# EAGLE design controller (EAGLE 9.6.2)
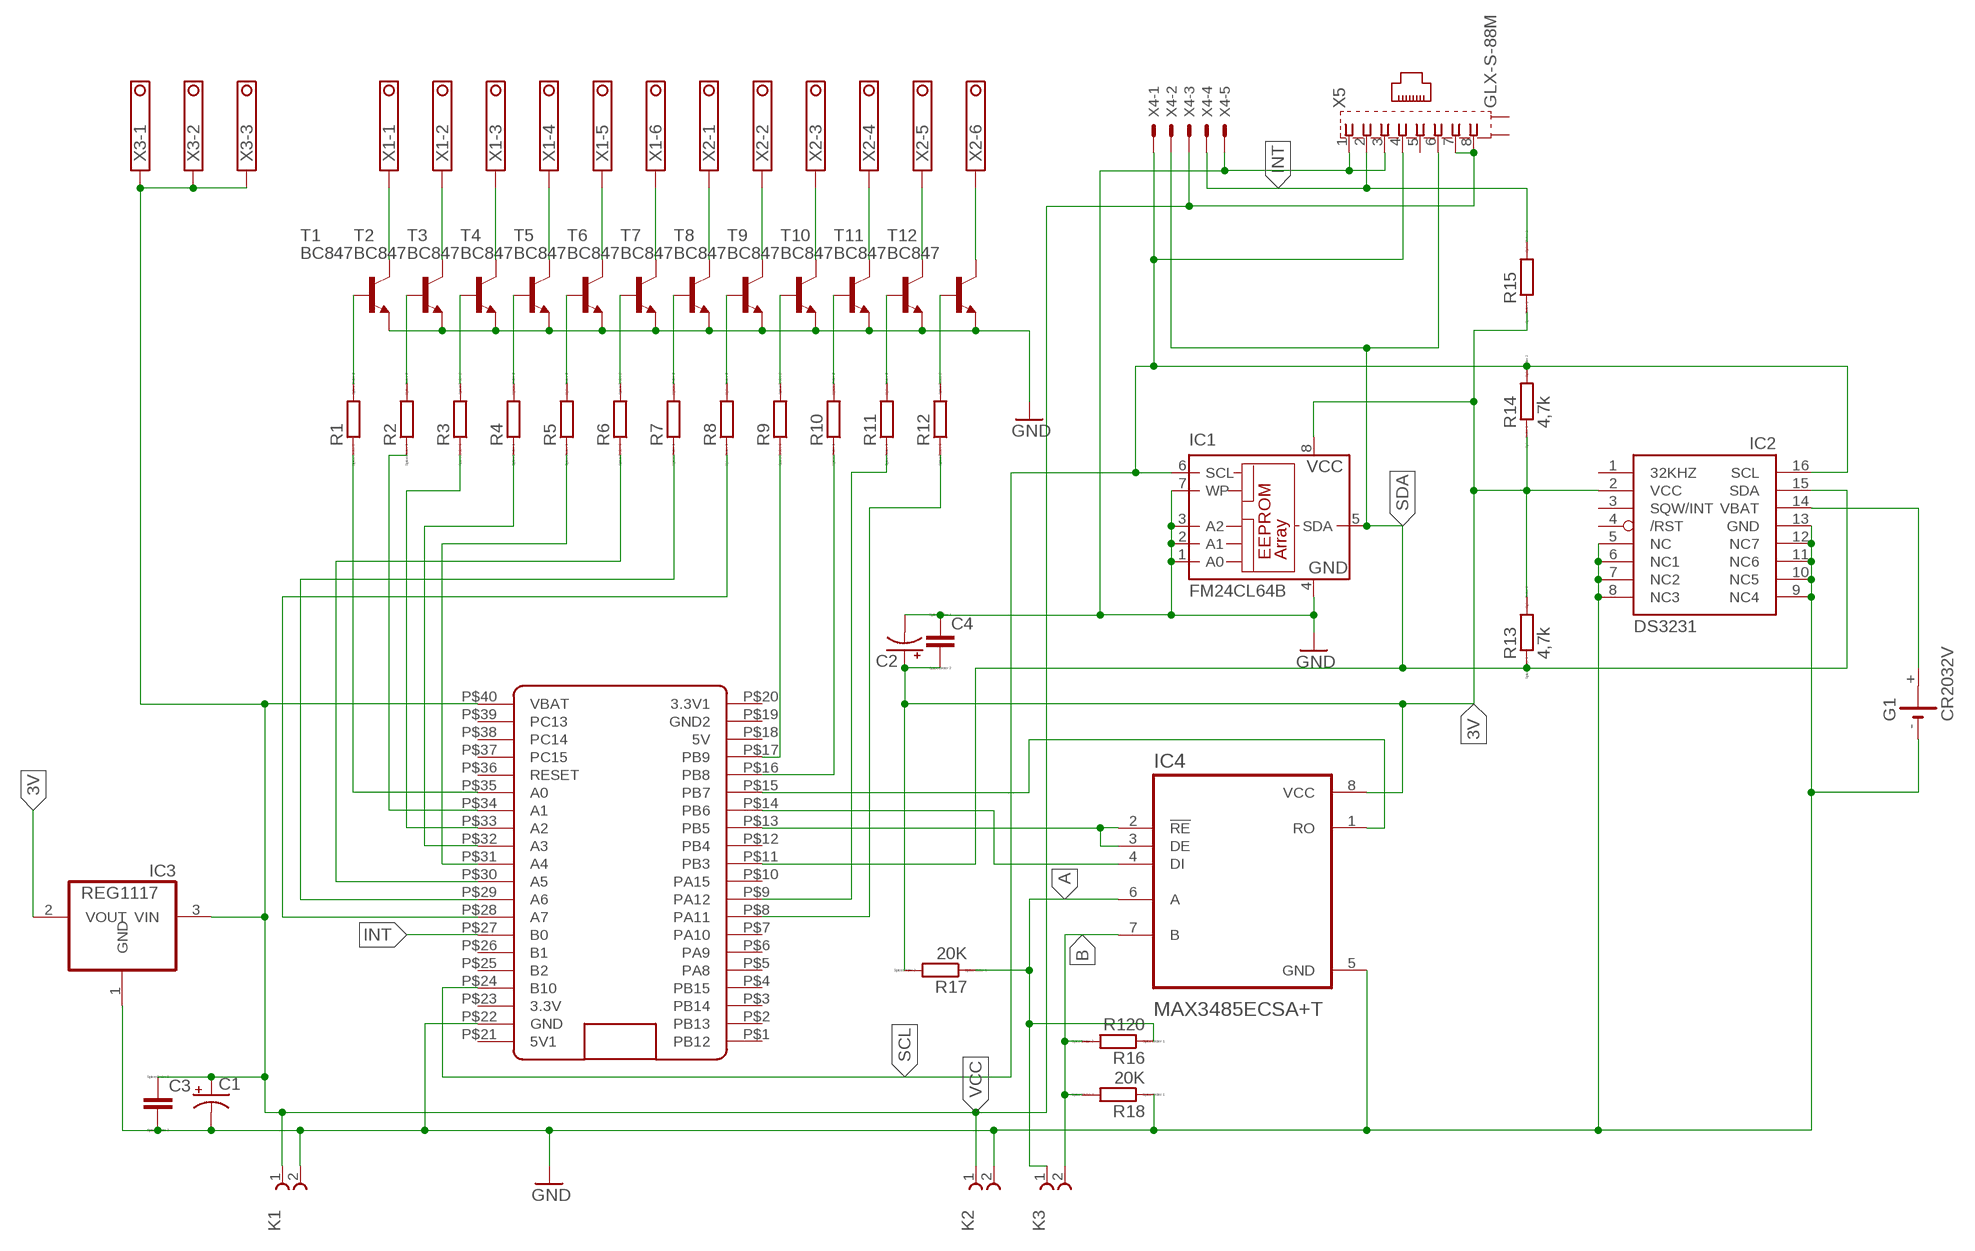
[diagram p0: schematic, sheet 1]

## Parts
C1  CPOL-US153CLV-0810  [153CLV-0810]
C2  CPOL-US153CLV-0810  [153CLV-0810]
C3  C  [C0805]
C4  C  [C0805]
G1  CR2032V  [CR2032V]
IC1  FM24CL64B  24C64SM  [SO-08M]
IC2  DS3231  DS3231/SO  [SO16W]
IC3  REG1117  [SOT223]
IC4  MAX3485ECSA+T  [SOIC127P600X175-8N]
K1  691218410002  [691218410002]
K2  691218410002  [691218410002]
K3  691218410002  [691218410002]
R1  RR1206  [R1206]
R2  RR1206  [R1206]
R3  RR1206  [R1206]
R4  RR1206  [R1206]
R5  RR1206  [R1206]
R6  RR1206  [R1206]
R7  RR1206  [R1206]
R8  RR1206  [R1206]
R9  RR1206  [R1206]
R10  RR1206  [R1206]
R11  RR1206  [R1206]
R12  RR1206  [R1206]
R13  4,7k  RR1206  [R1206]
R14  4,7k  RR1206  [R1206]
R15  RR1206  [R1206]
R16  R120  RR1206  [R1206]
R17  20K  RR1206  [R1206]
R18  20K  RR1206  [R1206]
T1  BC847  [SOT23]
T2  BC847  [SOT23]
T3  BC847  [SOT23]
T4  BC847  [SOT23]
T5  BC847  [SOT23]
T6  BC847  [SOT23]
T7  BC847  [SOT23]
T8  BC847  [SOT23]
T9  BC847  [SOT23]
T10  BC847  [SOT23]
T11  BC847  [SOT23]
T12  BC847  [SOT23]
U$1  BLACK_STM32F411  [BLACK_PILL]
X1  TERMINAL-BLOCK-3.5MM-6-PIN-LONG-PAD  [TERMINAL-BLOCK-6-PIN-3.5MM-LONG-PAD]
X2  TERMINAL-BLOCK-3.5MM-6-PIN-LONG-PAD  [TERMINAL-BLOCK-6-PIN-3.5MM-LONG-PAD]
X3  TERMINAL-BLOCK-3.5MM-3-PIN-LONG-PAD  [TERMINAL-BLOCK-3-PIN-3.5MM-LONG-PAD]
X4  JST-XH-05-PIN-LONG-PAD  [JST-XH-05-PACKAGE-LONG-PAD]
X5  GLX-S-88M  [GLX-S-88M]

## Nets
3V: C2.+ C4.2 IC1.8(VCC) IC2.2(VCC) IC3.2(VOUT) IC4.8(VCC) R13.2 R14.1 R15.1 R17.2
A: IC4.6(A) K3.1 R16.1 R17.1
B: IC4.7(B) K3.2 R16.2 R18.2
GND: C1.- C2.- C3.2 C4.1 G1.- IC1.1(A0) IC1.2(A1) IC1.3(A2) IC1.4(GND) IC1.7(WP) IC2.5(NC) IC2.6(NC1) IC2.7(NC2) IC2.8(NC3) IC2.9(NC4) IC2.10(NC5) IC2.11(NC6) IC2.12(NC7) IC2.13(GND) IC3.1(GND) IC4.5(GND) K1.2 K2.2 R18.1 T1.2(E) T2.2(E) T3.2(E) T4.2(E) T5.2(E) T6.2(E) T7.2(E) T8.2(E) T9.2(E) T10.2(E) T11.2(E) T12.2(E) U$1.P$22(GND) X4.5 X5.1 X5.3
INT: R15.2 U$1.P$27(B0) X4.4 X5.2
N$3: G1.+ IC2.14(VBAT)
N$4: IC4.2(!RE) IC4.3(DE) U$1.P$13(PB5)
N$5: IC4.4(DI) U$1.P$14(PB6)
N$6: IC4.1(RO) U$1.P$15(PB7)
N$7: R1.1 U$1.P$35(A0)
N$8: R2.1 U$1.P$34(A1)
N$9: R3.1 U$1.P$33(A2)
N$10: R4.1 U$1.P$32(A3)
N$11: R5.1 U$1.P$31(A4)
N$12: R6.1 U$1.P$30(A5)
N$13: R7.1 U$1.P$29(A6)
N$14: R8.1 U$1.P$28(A7)
N$15: R9.1 U$1.P$17(PB9)
N$16: R10.1 U$1.P$16(PB8)
N$17: R11.1 U$1.P$9(PA12)
N$18: R12.1 U$1.P$8(PA11)
N$19: R1.2 T1.1(B)
N$20: R2.2 T2.1(B)
N$21: R3.2 T3.1(B)
N$22: R4.2 T4.1(B)
N$23: R5.2 T5.1(B)
N$24: R6.2 T6.1(B)
N$25: R7.2 T7.1(B)
N$26: R8.2 T8.1(B)
N$27: R9.2 T9.1(B)
N$28: R10.2 T10.1(B)
N$29: R11.2 T11.1(B)
N$30: R12.2 T12.1(B)
N$32: T1.3(C) X1.1
N$33: T2.3(C) X1.2
N$34: T3.3(C) X1.3
N$35: T4.3(C) X1.4
N$36: T5.3(C) X1.5
N$37: T6.3(C) X1.6
N$38: T7.3(C) X2.1
N$39: T8.3(C) X2.2
N$40: T9.3(C) X2.3
N$41: T10.3(C) X2.4
N$42: T11.3(C) X2.5
N$43: T12.3(C) X2.6
SCL: IC1.6(SCL) IC2.16(SCL) R14.2 U$1.P$24(B10) X4.1 X5.4
SDA: IC1.5(SDA) IC2.15(SDA) R13.1 U$1.P$11(PB3) X4.2 X5.6
VCC: C1.+ C3.1 IC3.3(VIN) K1.1 K2.1 U$1.P$40(VBAT) X3.1 X3.2 X3.3 X4.3 X5.7 X5.8
Unconnected: G1.+@1(+) IC2.1(32KHZ) IC2.3(SQW/INT) IC2.4(/RST) U$1.P$1(PB12) U$1.P$2(PB13) U$1.P$3(PB14) U$1.P$4(PB15) U$1.P$5(PA8) U$1.P$6(PA9) U$1.P$7(PA10) U$1.P$10(PA15) U$1.P$12(PB4) U$1.P$18(5V) U$1.P$19(GND2) U$1.P$20(3.3V1) U$1.P$23(3.3V) U$1.P$25(B2) U$1.P$26(B1) U$1.P$36(RESET) U$1.P$37(PC15) U$1.P$38(PC14) U$1.P$39(PC13) X5.5 X5.S1 X5.S2

## Power pins joined to a net without a drawn wire
5V1: U$1.P$21(5V1)

## Library data of the parts
C1 C2 = adafruit:CPOL-US: POLARIZED CAPACITOR, American symbol
C3 C4 = eagle-ltspice:C: CAPACITOR, European symbol; SPICEMODEL: NONE; SPICEPREFIX: C
G1 = battery:CR2032V: LI BATTERY Varta
IC1 = microchip:24*: Serial EEPROM I2C; MF: RAMTRON INTERNATIONAL CORP; MPN: FM24C64-S; OC_FARNELL: 9882685; OC_NEWARK: 98H0189
IC2 = adafruit:DS3231
IC3 = burr-brown:REG1117: 800mA and 1A Low Dropout (LDO) Positive Regulator 1.8V, 2.5V, 2.85V, 3.3V, 5V, and Adj; MPN: REG1117; OC_FARNELL: 1097566; OC_NEWARK: 14P6981
IC4 = MAX3485ECSA_T:MAX3485ECSA+T: Check prices <https://pricing.snapeda.com/parts/MAX3485ECSA%2BT/Maxim%20Integrated/view-part?ref=eda>; AVAILABILITY: Warning; DESCRIPTION: 1/1 Transceiver Half RS422, RS485 8-SOIC; MF: Maxim Integrated; MP: MAX3485ECSA+T; PACKAGE: SOIC-8 Maxim; PRICE: None; PURCHASE-URL: https://pricing.snapeda.com/search/part/MAX3485ECSA+T/?ref=eda
K1-K3 = Wurth_Elektronik_Electromechanic_Terminal_Blocks_Connectors_rev15c:691218410002: WR-TBL Serie 2184 - 7.62mm Horizontal Entry Modular with Rising Cage Clamp - 5.3mm2 Wires, 2 Pins=>Code : Con_TBL_Screw_RisingClamp_7.62_691218410002 <http://katalog.we-online.de/media/images/eican/Con_TBL_Screw_RisingClamp_7.62_6912184100xx_pf2.jpg> Details see: http://katalog.we-online.de/en/em/691_218_410_0xx Created 2014-06-18, Karrer Zheng 2014 (C) Würth Elektronik
R1-R18 = eagle-ltspice:R: RESISTOR, European symbol; SPICEMODEL: NONE; SPICEPREFIX: R
T1-T12 = nxp_60:BC847: 45 V, 100 mA NPN general-purpose transistors NPN general-purpose transistor AAL Eindhoven MK
U$1 = BluePill:BLACK_STM32F411
X1 X2 = Rembrandt Electronics - Terminal Block 3-5mm v1-0:TERMINAL-BLOCK-3.5MM-6-PIN: Terminal Block 3.5mm Pitch: 3,5 mm Number of pins: 6 Created by Rembrandt Electronics www.rembrandtelectronics.com
X3 = Rembrandt Electronics - Terminal Block 3-5mm v1-0:TERMINAL-BLOCK-3.5MM-3-PIN: Terminal Block 3.5mm Pitch: 3,5 mm Number of pins: 3 Created by Rembrandt Electronics www.rembrandtelectronics.com
X4 = Rembrandt Electronics - JST XH Connectors v1-0:JST-XH-05-PIN: JST XH Connector 2 Pin Wire to board connector. Pitch: 2,54 mm, (0.100") Number of pins: 5 Created by Rembrandt Electronics www.rembrandtelectronics.com
X5 = con-kycon:GLX-S-88M: Mod. Jack, Right Angle, 8 posiotion, 8 contatcs RJ45 Source: GLX-S-88M.pdf; OC_FARNELL: unknown; OC_NEWARK: unknown

## Board
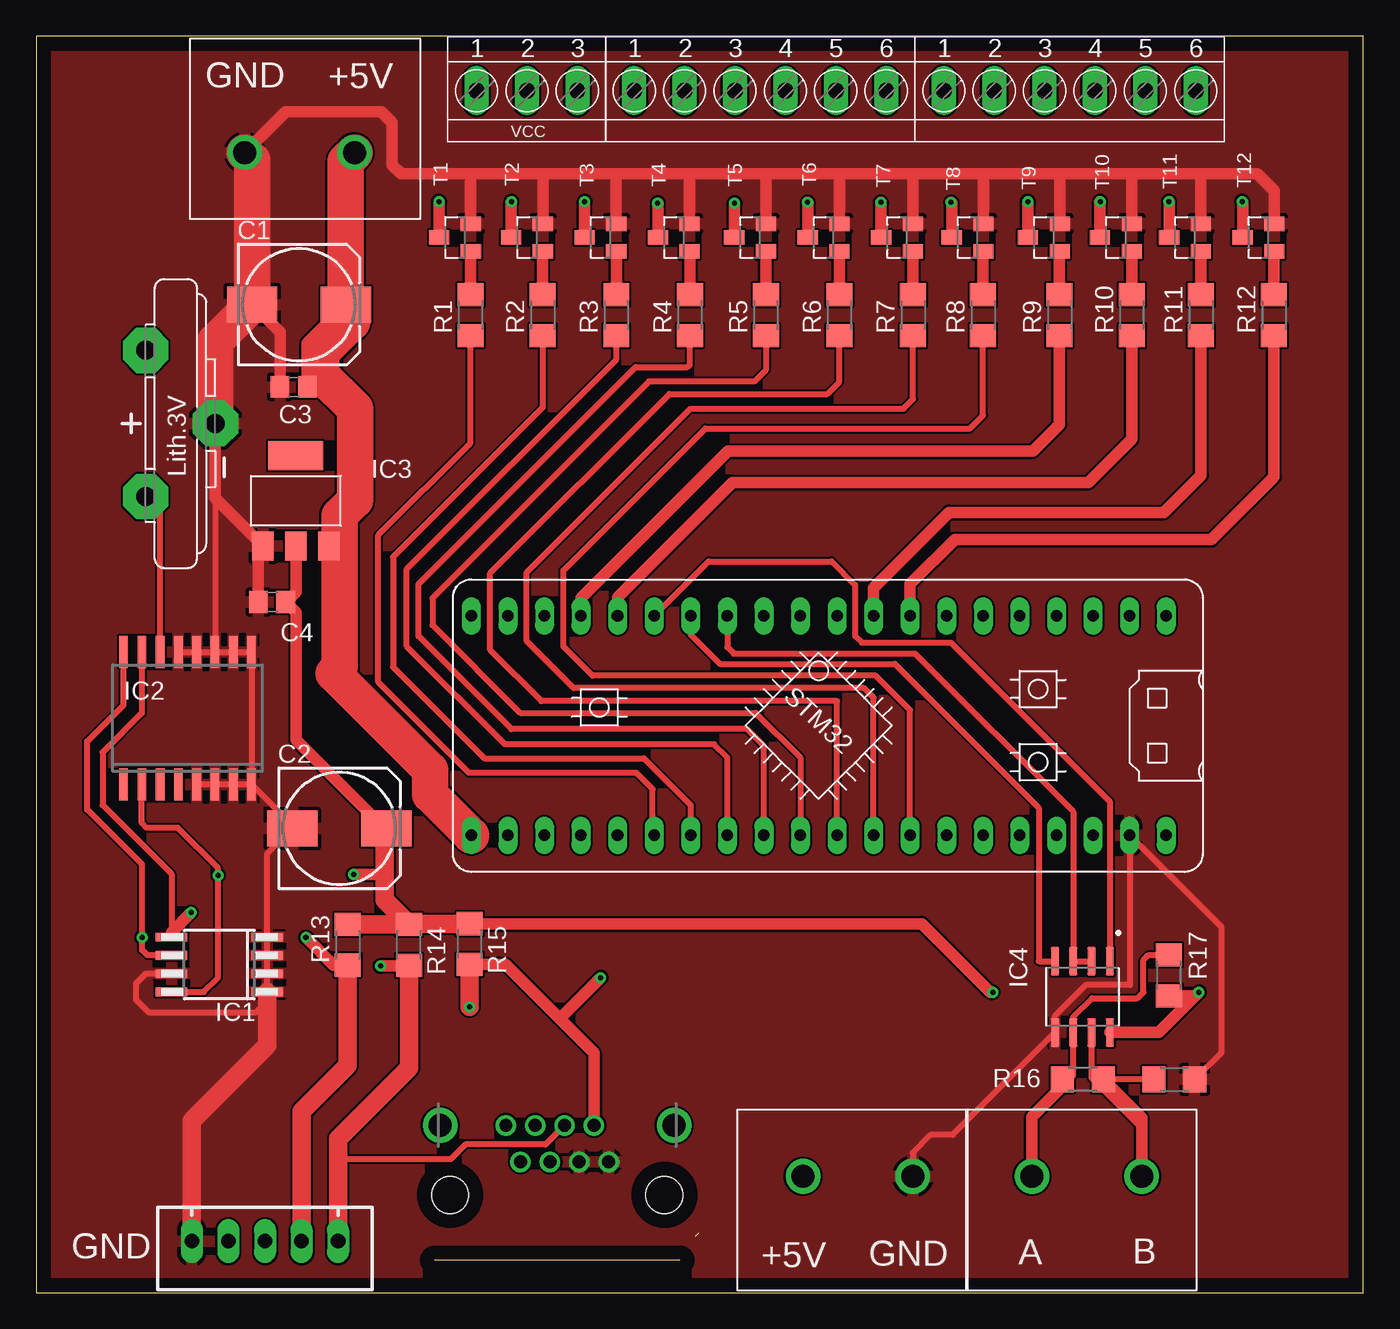
[diagram p1: board, top side]
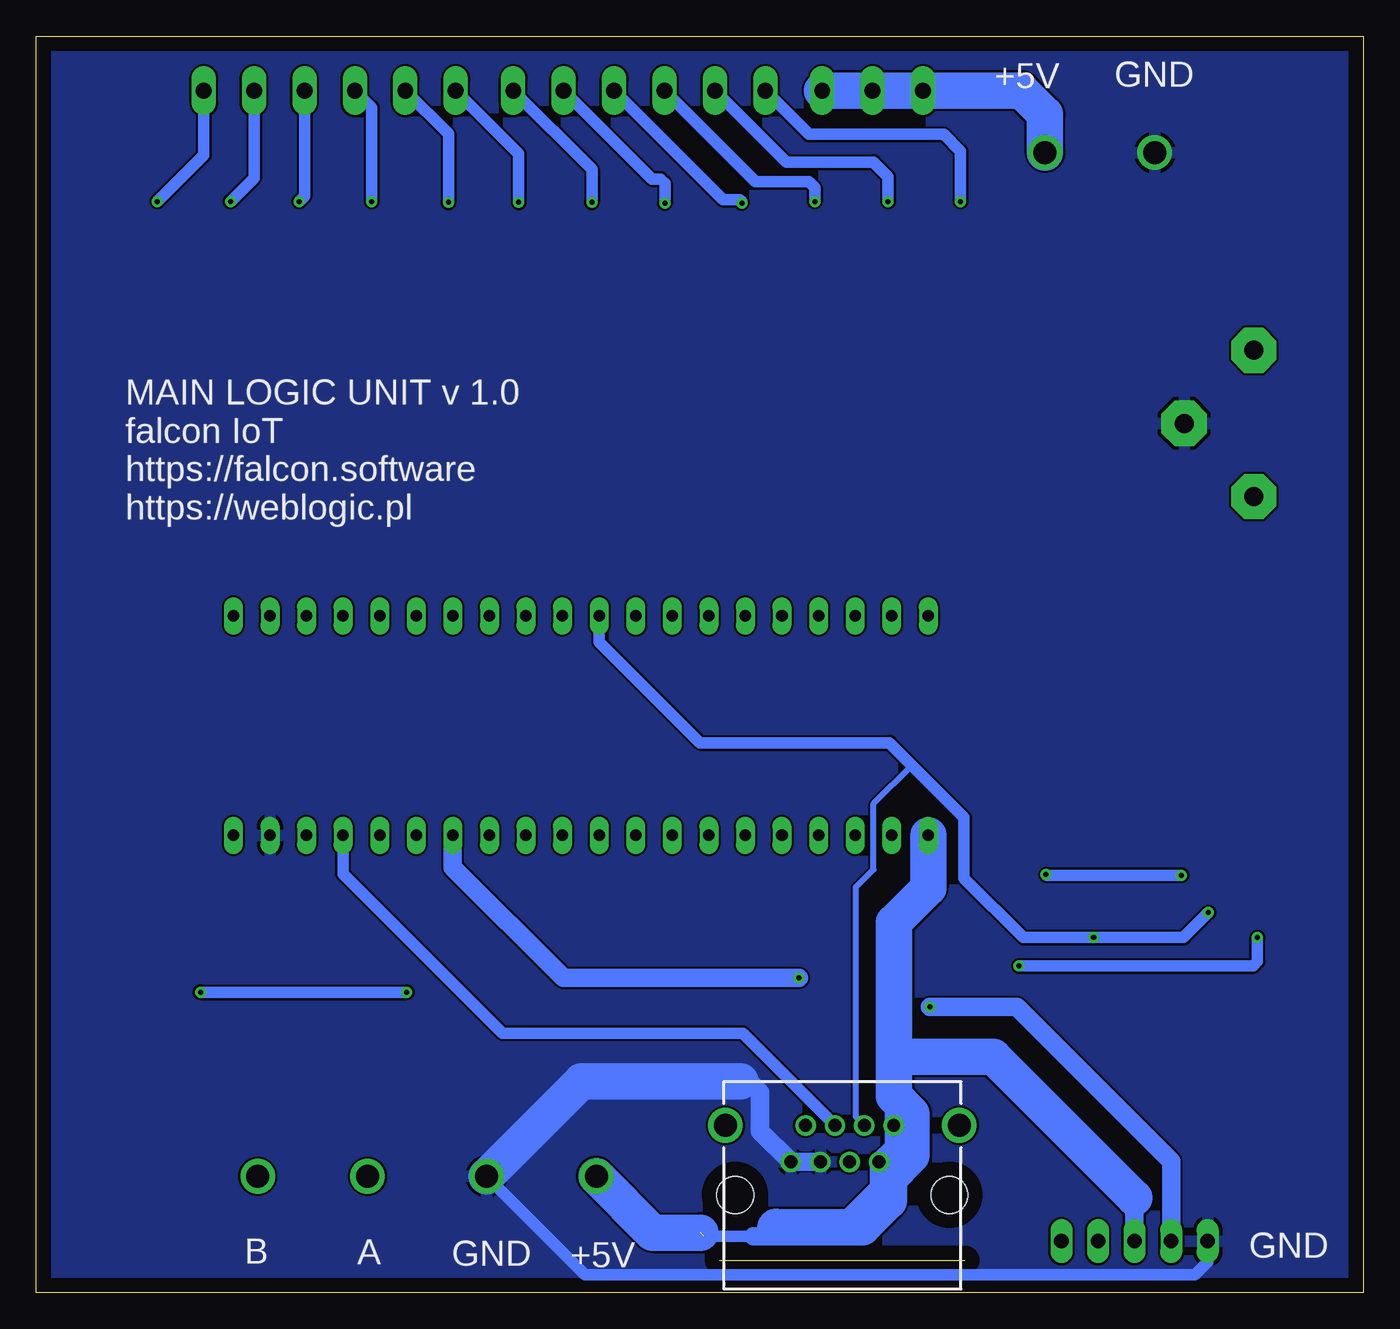
[diagram p2: board, bottom side, seen from below]

Size 92.2 x 87.3 mm. Coordinates in mm from the lower left corner, seen from the top.
Outline: 0,0 92.2,0 92.2,87.3 0,87.3 0,0
Copper layers (1*16): Top 0.035mm / dielectric 1.5mm / Bottom 0.035mm
Design rules "default": minimum track width 6mil, minimum drill 0.35mm, track to track 6mil, track to pad 6mil, pad to pad 6mil, via to via 6mil, smd to smd 6mil, copper to edge 40mil, drill to drill 6mil, minimum pad ring 10mil, minimum via ring 8mil, stop-mask expansion 4mil, vias tented up to drill 0mil, thermal gap 10mil

### Footprints (pad centres in the part's own frame; a part is rotated, then mirrored left to right if it is on the bottom)
153CLV-0810 = smd 3.5 x 2.5: + 3.25,0; - -3.25,0
C0805 = smd 1.3 x 1.5: 1 -0.95,0; 2 0.95,0
CR2032V = drill 1.321 pad 3.15 octagon: + -2.54,-5.08; +@1 -2.54,5.08; - 2.286,0
SO-08M = smd 0.6 x 2.2: 1 -1.905,-3.33; 2 -0.635,-3.33; 3 0.635,-3.33; 4 1.905,-3.33; 5 1.905,3.33; 6 0.635,3.33; 7 -0.635,3.33; 8 -1.905,3.33
SO16W = smd 0.6 x 2.2: 1 -4.445,-4.6; 2 -3.175,-4.6; 3 -1.905,-4.6; 4 -0.635,-4.6; 5 0.635,-4.6; 6 1.905,-4.6; 7 3.175,-4.6; 8 4.445,-4.6; 9 4.445,4.6; 10 3.175,4.6; 11 1.905,4.6; 12 0.635,4.6; 13 -0.635,4.6; 14 -1.905,4.6; 15 -3.175,4.6; 16 -4.445,4.6
SOT223 = smd 1.499 x 2.007: 1 -2.261,-3.15; 2 0.025,-3.15; 3 2.311,-3.15 | smd 3.81 x 2.007: 4 0,3.15
SOIC127P600X175-8N = smd 1.97 x 0.59: 1 -2.475,1.905; 2 -2.475,0.635; 3 -2.475,-0.635; 4 -2.475,-1.905; 5 2.475,-1.905; 6 2.475,-0.635; 7 2.475,0.635; 8 2.475,1.905
691218410002 = drill 1.6: 1 -7.62,0; 2 0,0
R1206 = smd 1.6 x 1.803: 1 -1.422,0; 2 1.422,0
SOT23 = smd 1 x 1.4: 1 -0.95,-1.1; 2 0.95,-1.1; 3 0,1.1
BLACK_PILL = drill 0.8 long: P$1 -7.62,15.24; P$2 -7.62,12.7; P$3 -7.62,10.16; P$4 -7.62,7.62; P$5 -7.62,5.08; P$6 -7.62,2.54; P$7 -7.62,0; P$8 -7.62,-2.54; P$9 -7.62,-5.08; P$10 -7.62,-7.62; P$11 -7.62,-10.16; P$12 -7.62,-12.7; P$13 -7.62,-15.24; P$14 -7.62,-17.78; P$15 -7.62,-20.32; P$16 -7.62,-22.86; P$17 -7.62,-25.4; P$18 -7.62,-27.94; P$19 -7.62,-30.48; P$20 -7.62,-33.02; P$21 7.62,15.24; P$22 7.62,12.7; P$23 7.62,10.16; P$24 7.62,7.62; P$25 7.62,5.08; P$26 7.62,2.54; P$27 7.62,0; P$28 7.62,-2.54; P$29 7.62,-5.08; P$30 7.62,-7.62; P$31 7.62,-10.16; P$32 7.62,-12.7; P$33 7.62,-15.24; P$34 7.62,-17.78; P$35 7.62,-20.32; P$36 7.62,-22.86; P$37 7.62,-25.4; P$38 7.62,-27.94; P$39 7.62,-30.48; P$40 7.62,-33.02
TERMINAL-BLOCK-6-PIN-3.5MM-LONG-PAD = drill 1.1 pad 1.7 long: 1 -8.75,-0.1; 2 -5.25,-0.1; 3 -1.75,-0.1; 4 1.75,-0.1; 5 5.25,-0.1; 6 8.75,-0.1
TERMINAL-BLOCK-3-PIN-3.5MM-LONG-PAD = drill 1.1 pad 1.7 long: 1 -3.5,-0.1; 2 0,-0.1; 3 3.5,-0.1
JST-XH-05-PACKAGE-LONG-PAD = drill 1.016 long: 1 -5.08,0; 2 -2.54,0; 3 0,0; 4 2.54,0; 5 5.08,0
GLX-S-88M = drill 0.9 pad 1.422: 1 -3.57,-2.3; 2 -2.55,-4.84; 3 -1.53,-2.3; 4 -0.51,-4.84; 5 0.51,-2.3; 6 1.53,-4.84; 7 2.55,-2.3; 8 3.57,-4.84 | drill 1.6 pad 2.184: S1 -8.125,-4.84; S2 8.125,-4.84 | hole 2.55: -7.44,0; 7.44,0

### Placement (x,y rotation side)
C1  18.27,68.64 0 top
C2  21.07,32.27 0 top
C3  17.89,62.93 180 top
C4  16.4,47.99 0 top
G1  10.16,60.39 0 top
IC1  12.74,22.81 90 top
IC2  10.53,39.92 0 top
IC3  18.03,55.02 0 top
IC4  72.68,20.56 270 top
K1  14.5,79.2 180 top
K2  60.9,8.1 0 top
K3  76.8,8.1 0 top
R1  30.18,67.91 90 top
R2  35.19,67.91 90 top
R3  40.3,67.91 90 top
R4  45.42,67.91 90 top
R5  50.68,67.91 90 top
R6  55.8,67.91 90 top
R7  60.91,67.91 90 top
R8  65.77,67.91 90 top
R9  71.09,67.91 90 top
R10  76.1,67.91 90 top
R11  80.91,67.91 90 top
R12  85.98,67.91 90 top
R13  21.66,24.19 90 top
R14  25.91,24.17 270 top
R15  30.12,24.23 270 top
R16  72.69,14.83 0 top
R17  78.69,22.05 270 top
R18  79.04,14.83 180 top
T1  29.1,73.3 90 top
T2  34.1,73.3 90 top
T3  39.2,73.3 90 top
T4  44.3,73.3 90 top
T5  49.6,73.3 90 top
T6  54.7,73.3 90 top
T7  59.8,73.3 90 top
T8  64.7,73.3 90 top
T9  70,73.3 90 top
T10  75,73.3 90 top
T11  79.8,73.3 90 top
T12  84.9,73.3 90 top
U$1  63.25,39.4 270 top
X1  50.3,83.6 0 top
X2  71.8,83.6 0 top
X3  34.1,83.6 0 top
X4  15.9,3.6 180 top
X5  36.2,6.8 180 top

### Tracks (layer width: path | path; a pad name or v marks a point on that pad's centre or on a via)
3V  (via drill 0.35)
  Top 0.406: IC1.8 11.66,20.91 12.65,21.89 v12.65,29.01 12.65,29.52 9.86,32.31 7.67,32.31 7.35,32.63 IC2.2
  Top 0.813: IC3.2 18.06,48.7 C4.2 18.09,47.25 18.09,38.41 24.22,32.27 C2.+ | 24.22,29.06 v22.05,29.06 | R15.1 61.53,25.65 66.29,20.88 v66.45,20.88 | IC4.8 77.98,18.09 v80.77,20.88 80.52,20.62 R17.2
  Top 1.27: R13.2 25.89,25.61 R14.1 | R14.1 25.96,25.65 R15.1 | R14.1 24.22,27.29 24.22,29.06 24.22,32.27
  Bottom 0.813: v12.65,29.01 22,29.01 v22.05,29.06 | v80.77,20.88 v66.45,20.88
A
  Top 0.406: IC4.6 72.04,15.09 71.3,14.35 | IC4.6 72.04,19.16 73.36,20.47 76.5,20.47 76.91,20.88 76.91,23.11 77.27,23.47 R17.1 | R16.1 72.04,15.6 IC4.6
  Top 0.813: K3.1 69.18,12.23 71.3,14.35
B
  Top 0.406: IC4.7 73.31,14.93 76.8,11.44 K3.2 | R18.2 R16.2
  Top 0.813: K3.2 76.8,12.15 R16.2
GND
  Top 0.406: K2.2 60.9,9.74 62.13,10.97 63.65,10.97 IC4.5 70.77,19.26 72.9,21.39 76,21.39 76,31.73 | 76,31.73 U$1.P$22 | IC2.13 IC2.12 IC2.11 | IC2.11 IC2.10 IC2.9 IC2.8 | G1.- 12.45,44.54 IC2.11 | IC2.8 IC2.7 IC2.6 IC2.5 | IC2.8 17.82,32.47 C2.- 16.07,30.52 IC1.4 IC1.3 IC1.2 IC1.1 16.07,20.29 15.24,19.46 7.87,19.46 6.96,20.37 6.96,21.49 7.65,22.18 IC1.7 | R18.1 82.35,16.71 82.35,25.38 76,31.73
  Top 0.813: T12.2 86,76.56 84.84,77.72 80.82,77.72 | 80.82,77.72 76,77.72 | 76,77.72 71.22,77.72 | 71.22,77.72 65.73,77.72 | 65.73,77.72 60.96,77.72 | 60.96,77.72 55.78,77.72 | 55.78,77.72 50.8,77.72 | 50.8,77.72 45.36,77.72 | 45.36,77.72 40.28,77.72 | 40.28,77.72 35.2,77.72 | 35.2,77.72 30.28,77.72 | 30.28,77.72 25.35,77.72 24.74,78.33 24.74,81.28 23.98,82.04 17.34,82.04 K1.2 | T1.2 30.2,77.65 30.28,77.72 | T2.2 35.2,77.72 | T3.2 40.3,77.71 40.28,77.72 | T4.2 45.4,77.69 45.36,77.72 | T5.2 50.7,77.62 50.8,77.72 | T6.2 55.8,77.7 55.78,77.72 | T7.2 60.9,77.66 60.96,77.72 | T8.2 65.8,77.66 65.73,77.72 | T9.2 71.1,77.6 71.22,77.72 | T10.2 76.1,77.62 76,77.72 | T11.2 80.9,77.65 80.82,77.72 | C3.2 16.94,66.72 C1.- | G1.- 12.45,55.19 IC3.1 15.45,51.54 C4.1
  Top 1.27: X4.5 10.82,11.94 16.07,17.19 IC1.1
  Top 2.54: K1.2 15.02,78.69 C1.- 12.45,66.08 G1.-
  Bottom 0.813: K2.2 54.07,1.27 11.73,1.27 10.82,2.18 X4.5
  Bottom 1.27: X5.3 X5.1 41.91,11.24 41.91,13.92 42.67,14.68 43.28,14.68
  Bottom 2.54: K2.2 54.32,14.68 43.28,14.68
  pour Top: 0.1,87.17 92,87.17 92.1,87.07 92.1,0.25 91.74,-0.1 0.41,-0.1 0.1,-0.41
  pour Bottom: 0.1,87.27 92.2,87.27 92.2,0.1 92.3,0 0.2,0 0.1,-0.1
INT  (via drill 0.35)
  Top 0.813: R15.2 32.62,22.8 36.32,19.1 | X5.2 38.75,16.67 36.32,19.1 | v39.22,21.89 36.42,19.1 36.32,19.1
  Top 1.27: R15.2 v30.12,19.86
  Bottom 1.27: X4.4 13.36,9.14 24.08,19.86 v30.12,19.86 | U$1.P$27 63.25,29.57 55.58,21.89 v39.22,21.89
N$3
  Top 0.406: IC2.14 8.62,54.31 G1.+
N$4
  Top 0.406: IC4.2 IC4.3 72.03,33.43 61.06,44.4 48.46,44.4 48.01,44.85 U$1.P$13
N$5
  Top 0.406: U$1.P$14 45.47,45.72 47.5,43.69 59.64,43.69 69.65,33.68 69.65,23.04 IC4.4
N$6
  Top 0.406: U$1.P$15 46.71,50.8 55.27,50.8 56.9,49.17 56.9,45.62 57.35,45.16 63.55,45.16 74.57,34.14 IC4.1
N$7
  Top 0.406: U$1.P$35 42.82,31.89 42.82,35 41.71,36.12 30.07,36.12 23.77,42.42 23.77,52.63 30.18,59.03 R1.1
N$8
  Top 0.406: R2.1 35.19,61.5 24.79,51.1 24.79,43.48 31.14,37.13 42.22,37.13 45.47,33.88 U$1.P$34
N$9
  Top 0.406: U$1.P$33 48.01,37.18 47.09,38.1 32.56,38.1 25.76,44.91 25.76,50.29 40.3,64.84 R3.1
N$10
  Top 0.406: U$1.P$32 50.55,37.99 49.38,39.17 33.02,39.17 26.57,45.62 26.57,49.23 41.66,64.31 45.26,64.31 45.42,64.47 R4.1
N$11
  Top 0.406: R5.1 50.69,64.1 49.89,63.3 42.57,63.3 27.53,48.26 27.53,46.38 33.63,40.28 49.99,40.28 53.09,37.18 U$1.P$31
N$12
  Top 0.406: U$1.P$30 55.63,41.1 35.1,41.1 31.55,44.65 31.55,49.99 43.99,62.43 54.97,62.43 55.8,63.27 R6.1
N$13
  Top 0.406: U$1.P$29 58.17,41.35 57.51,42.01 37.34,42.01 34.09,45.26 34.09,50.04 45.47,61.42 60.25,61.42 60.91,62.08 R7.1
N$14
  Top 0.406: U$1.P$28 60.71,40.48 58.32,42.88 38.66,42.88 36.63,44.91 36.63,50.19 46.48,60.05 64.87,60.05 65.77,60.95 R8.1
N$15
  Top 0.813: U$1.P$17 37.85,48.26 48.06,58.47 69.24,58.47 71.09,60.32 R9.1
N$16
  Top 0.813: U$1.P$16 40.39,48.31 48.36,56.29 73.1,56.29 76.1,59.29 R10.1
N$17
  Top 0.813: U$1.P$9 58.17,48.98 63.4,54.2 78.33,54.2 80.91,56.78 R11.1
N$18
  Top 0.813: U$1.P$8 60.71,49.23 63.8,52.32 81.64,52.32 85.98,56.67 R12.1
N$19
  Top 0.813: R1.2 30.18,72.33 T1.1
N$20
  Top 0.813: R2.2 35.19,72.34 T2.1
N$21
  Top 0.813: R3.2 T3.1
N$22
  Top 0.813: R4.2 45.42,72.33 T4.1
N$23
  Top 0.813: R5.2 50.69,72.33 T5.1
N$24
  Top 0.813: R6.2 T6.1
N$25
  Top 0.813: R7.2 60.91,72.34 T7.1
N$26
  Top 0.813: R8.2 65.77,72.32 T8.1
N$27
  Top 0.813: R9.2 T9.1
N$28
  Top 0.813: R10.2 T10.1
N$29
  Top 0.813: R11.2 80.91,72.34 T11.1
N$30
  Top 0.813: R12.2 85.98,72.33 T12.1
N$32  (via drill 0.35)
  Top 0.813: T1.3 v28,75.78 v27.99,75.79
  Bottom 0.813: X1.1 38.52,80.47 29.16,80.47 27.99,79.3 v27.99,75.79
N$33  (via drill 0.35)
  Top 0.813: T2.3 33,75.77 v33.02,75.79
  Bottom 0.813: X1.2 40.09,78.54 34.04,78.54 33.02,77.52 v33.02,75.79
N$34  (via drill 0.35)
  Top 0.813: T3.3 v38.1,75.79
  Bottom 0.813: X1.3 42.22,77.17 38.51,77.17 38.1,76.76 v38.1,75.79
N$35  (via drill 0.35)
  Top 0.813: T4.3 43.2,75.67 v43.18,75.69
  Bottom 0.813: X1.4 44.5,75.95 43.33,75.95 43.18,75.79 v43.18,75.69
N$36  (via drill 0.35)
  Top 0.813: T5.3 48.5,75.68 v48.51,75.69
  Bottom 0.813: X1.5 49.42,77.37 48.82,77.37 48.51,77.06 v48.51,75.69
N$37  (via drill 0.35)
  Top 0.813: T6.3 v53.6,75.74 v53.59,75.74
  Bottom 0.813: X1.6 53.59,78.04 v53.59,75.74
N$38  (via drill 0.35)
  Top 0.813: T7.3 58.7,75.72 v58.67,75.74
  Bottom 0.813: X2.1 58.67,79.12 v58.67,75.74
N$39  (via drill 0.35)
  Top 0.813: T8.3 63.6,75.69 v63.55,75.74
  Bottom 0.813: X2.2 63.55,80.5 v63.55,75.74
N$40  (via drill 0.35)
  Top 0.813: T9.3 68.9,75.78 v68.89,75.79
  Bottom 0.813: X2.3 68.89,82.33 v68.89,75.79
N$41  (via drill 0.35)
  Top 0.813: T10.3 v73.9,75.78 v73.91,75.79
  Bottom 0.813: X2.4 73.55,76.16 v73.91,75.79
N$42  (via drill 0.35)
  Top 0.813: T11.3 v78.7,75.78 v78.69,75.79
  Bottom 0.813: X2.5 77.05,77.43 v78.69,75.79
N$43  (via drill 0.35)
  Top 0.813: T12.3 83.8,75.76 v83.77,75.79
  Bottom 0.813: X2.6 80.55,79.01 v83.77,75.79
SCL  (via drill 0.35)
  Top 0.406: IC1.6 7.74,23.45 7.37,23.82 v7.37,24.69 7.37,29.77 3.56,33.58 3.56,38.3 6.08,40.83 IC2.16 | X5.4 35.38,10.31 29.82,10.31 28.8,9.29 21.13,9.29 20.98,9.14
  Top 0.813: R14.2 25.86,22.71 v23.93,22.71
  Top 1.27: X4.1 20.98,9.14 20.98,10.72 25.91,15.65 R14.2
  Bottom 0.813: X5.4 43.1,18.03 59.79,18.03 70.87,29.11 U$1.P$24 | v23.93,22.71 7.67,22.71 7.37,23.01 v7.37,24.69
SDA  (via drill 0.35)
  Top 0.406: IC2.15 7.35,40.27 4.62,37.54 4.62,33.88 9.41,29.1 9.41,24.99 IC1.5
  Top 0.813: v18.75,24.69 20.67,22.77 R13.1 | v10.77,26.42 9.41,25.05 9.41,24.99
  Top 1.27: X4.2 18.44,12.6 21.66,15.82 R13.1
  Bottom 0.406: X5.6 35.28,12.25 35.28,28.17 34.04,29.41 34.04,33.98 31.37,36.65
  Bottom 0.813: U$1.P$11 53.09,45.22 46.08,38.2 32.92,38.2 31.37,36.65 27.74,33.02 27.74,28.8 23.62,24.69 v18.75,24.69 12.5,24.69 v10.77,26.42
VCC  (1 unrouted)
  Top 0.813: C1.+ 18.84,65.97 C3.1 19.83,62.93 22.15,60.6 | 22.15,55.07 20.34,53.26 IC3.3 20.34,43.36 20.68,43.03
  Top 2.54: K1.1 21.52,78.59 C1.+ 21.95,68.21 21.95,67.41 19.81,65.28 19.81,63.75 22.15,61.42 22.15,60.6 22.15,55.07 21.08,54 21.08,43.43 20.68,43.03 27.38,36.32 27.38,34.63 U$1.P$40
  Bottom 0.813: 42.37,3.93 45.8,3.93
  Bottom 1.27: 42.37,3.93 37.03,3.93 33.65,7.31 X5.7 32.63,10.12 X5.8 32.63,16.41 | 15.9,6.6 X4.3
  Bottom 2.54: K1.1 22.12,81.86 23.76,83.5 X3.1 X3.2 X3.3 | U$1.P$40 30.23,28.14 32.63,25.74 32.63,16.41 | 32.63,16.41 25.7,16.41 15.9,6.6 | 32.63,16.41 32.63,13.68 31.39,12.45 31.39,9.55 32.97,7.98 32.97,6.4 34.8,4.57 40.84,4.57 40.81,4.59 | K2.1 49.36,4.18 46.06,4.18

### Text on the board
tNames: GND | +5V | VCC | GND | +5V | GND | A | B
bNames: GND | +5V | MAIN LOGIC UNIT v 1.0 / falcon IoT / https://falcon.software / https://weblogic.pl | GND | +5V | GND | A | B